# EAGLE design RJ45 4ch Output (EAGLE 9.4.2)
4 channel RJ45 output board. Sends 1 channel of RS485 out + power on each RJ45
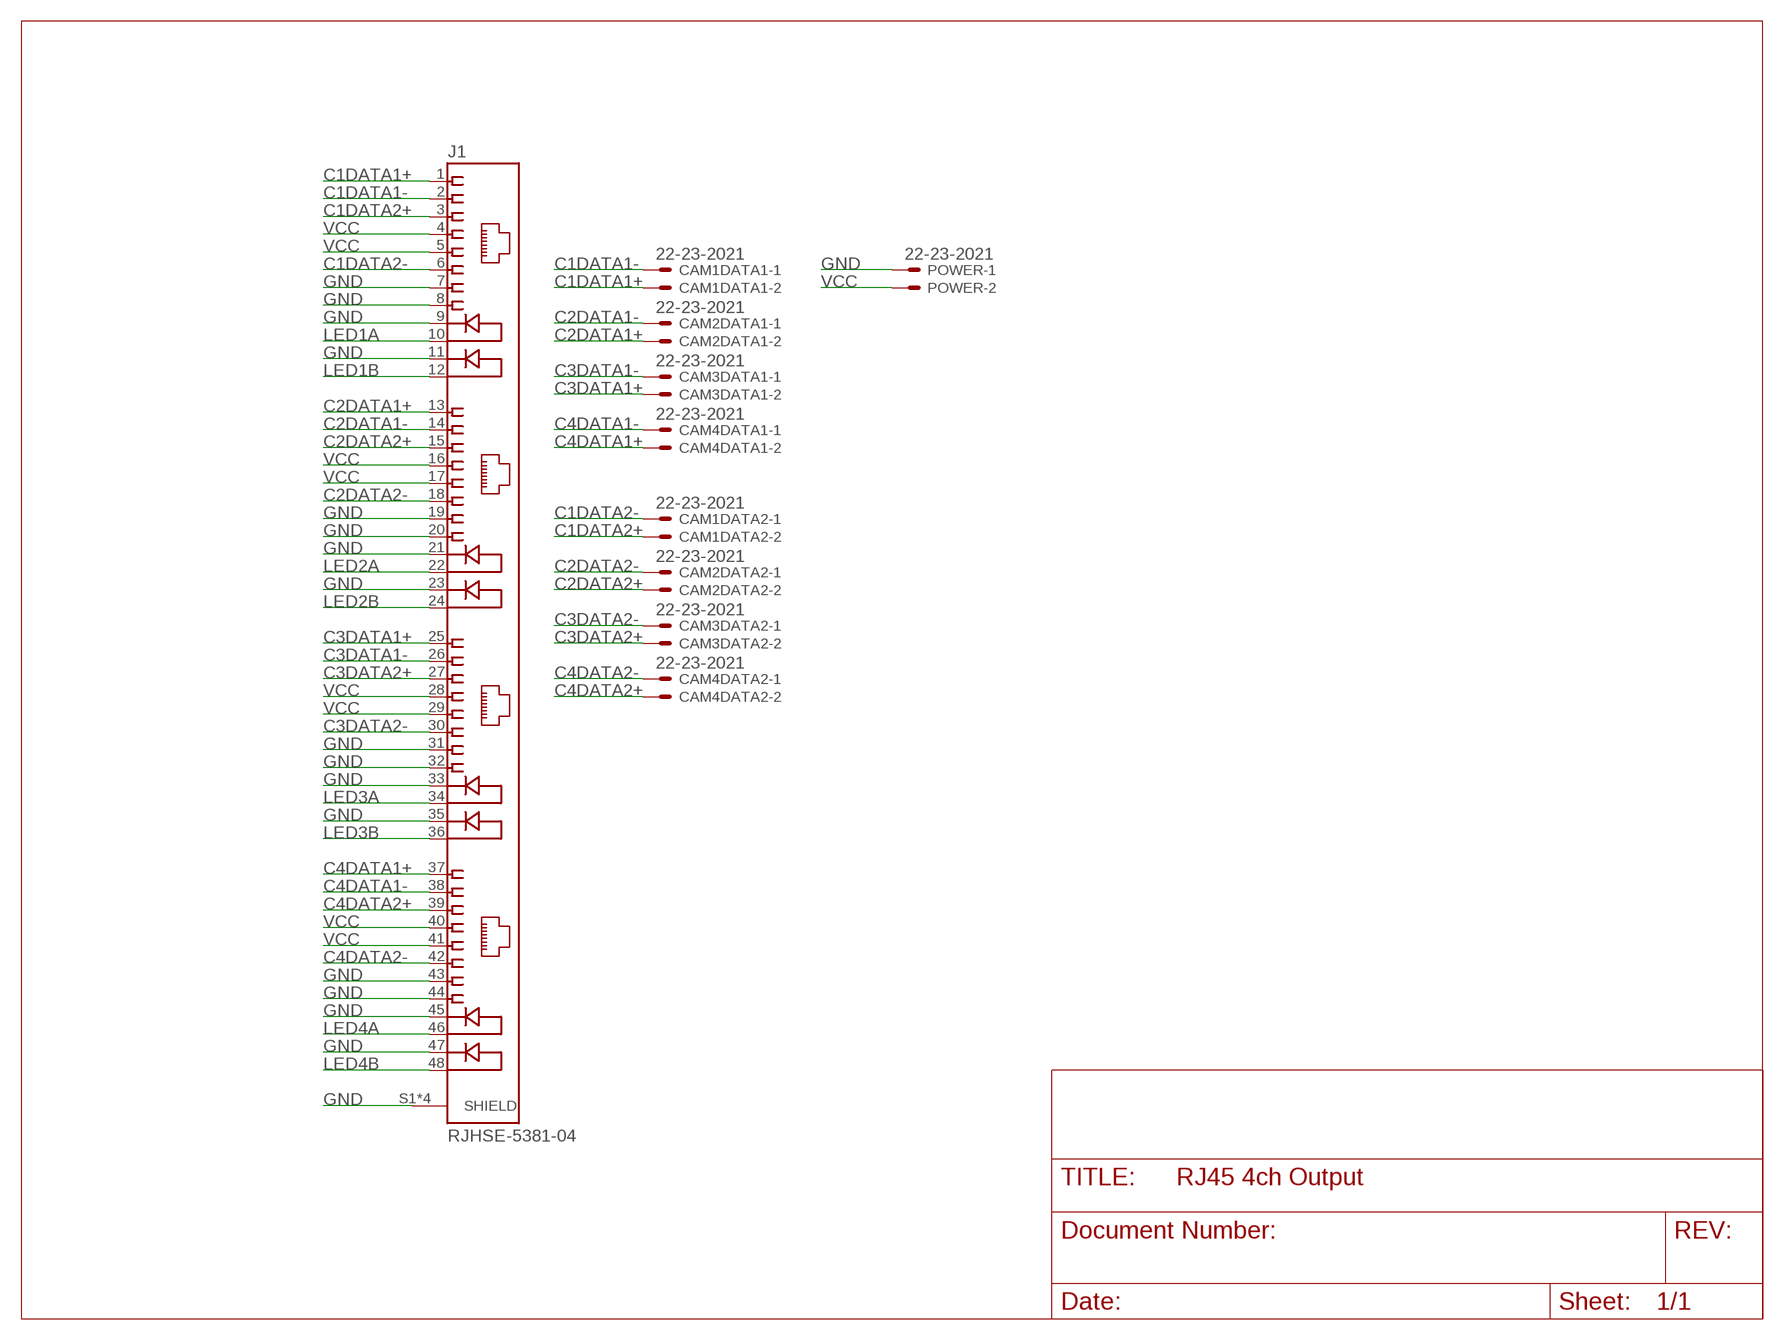
[diagram p0: schematic, sheet 1]

## Parts
CAM1DATA1  22-23-2021  [22-23-2021]
CAM1DATA2  22-23-2021  [22-23-2021]
CAM2DATA1  22-23-2021  [22-23-2021]
CAM2DATA2  22-23-2021  [22-23-2021]
CAM3DATA1  22-23-2021  [22-23-2021]
CAM3DATA2  22-23-2021  [22-23-2021]
CAM4DATA1  22-23-2021  [22-23-2021]
CAM4DATA2  22-23-2021  [22-23-2021]
J1  RJHSE-5381-04  [AMPHENOL_RJHSE-5381-04]
POWER  22-23-2021  [22-23-2021]

## Nets
C1DATA1+: CAM1DATA1.2 J1.1
C1DATA1-: CAM1DATA1.1 J1.2
C1DATA2+: CAM1DATA2.2 J1.3
C1DATA2-: CAM1DATA2.1 J1.6
C2DATA1+: CAM2DATA1.2 J1.13
C2DATA1-: CAM2DATA1.1 J1.14
C2DATA2+: CAM2DATA2.2 J1.15
C2DATA2-: CAM2DATA2.1 J1.18
C3DATA1+: CAM3DATA1.2 J1.25
C3DATA1-: CAM3DATA1.1 J1.26
C3DATA2+: CAM3DATA2.2 J1.27
C3DATA2-: CAM3DATA2.1 J1.30
C4DATA1+: CAM4DATA1.2 J1.37
C4DATA1-: CAM4DATA1.1 J1.38
C4DATA2+: CAM4DATA2.2 J1.39
C4DATA2-: CAM4DATA2.1 J1.42
GND: J1.7 J1.8 J1.9 J1.11 J1.19 J1.20 J1.21 J1.23 J1.31 J1.32 J1.33 J1.35 J1.43 J1.44 J1.45 J1.47 J1.S1(SHIELD) J1.S2(SHIELD) J1.S3(SHIELD) J1.S4(SHIELD) POWER.1
LED1A: J1.10
LED1B: J1.12
LED2A: J1.22
LED2B: J1.24
LED3A: J1.34
LED3B: J1.36
LED4A: J1.46
LED4B: J1.48
VCC: J1.4 J1.5 J1.16 J1.17 J1.28 J1.29 J1.40 J1.41 POWER.2

## Library data of the parts
CAM1DATA1 CAM1DATA2 CAM2DATA1 CAM2DATA2 CAM3DATA1 CAM3DATA2 CAM4DATA1 CAM4DATA2 POWER = con-molex:22-23-2021: .100" (2.54mm) Center Header - 2 Pin; MF: MOLEX; MPN: 22-23-2021; OC_FARNELL: 1462926; OC_NEWARK: 25C3832
J1 = RJHSE-5381-04:RJHSE-5381-04: Conn RJ-45 F 32 POS 2.03mm Solder RA Thru-Hole 48 Terminal 4 Port Cat 5; AVAILABILITY: Unavailable; DESCRIPTION: Conn RJ-45 F 32 POS 2.03mm Solder RA Thru-Hole 48 Terminal 4 Port Cat 5; MF: Amphenol ICC; MP: RJHSE-5381-04; PACKAGE: None; PRICE: None

## Board
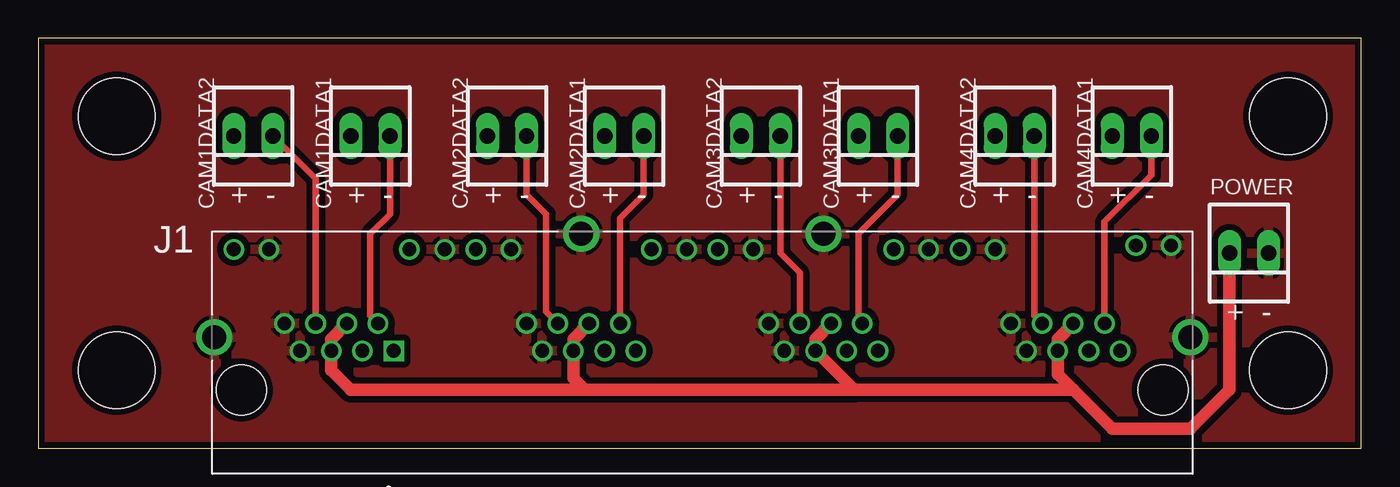
[diagram p1: board, top side]
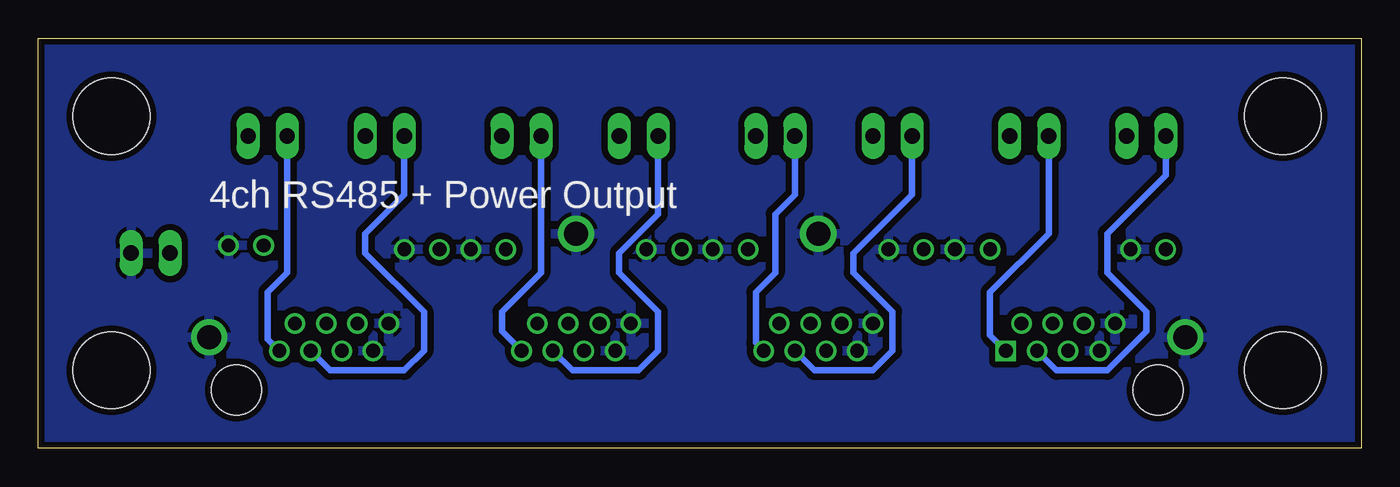
[diagram p2: board, bottom side, seen from below]

Size 86.03 x 26.66 mm. Coordinates in mm from the lower left corner, seen from the top.
Outline: 0,0 86.03,0 86.03,26.66 0,26.66 0,0
Copper layers (1*16): Top 0.035559375mm / dielectric 1.6mm / Bottom 0.035559375mm
Design rules "default": minimum track width 6mil, minimum drill 10mil, track to track 6mil, track to pad 6mil, pad to pad 6mil, via to via 6mil, smd to smd 6mil, copper to edge 15mil, drill to drill 6mil, minimum pad ring 5mil, minimum via ring 5mil, stop-mask expansion 2.5mil, vias tented up to drill 0mil, thermal gap 10mil
Holes 4.98 mm at 5.08,5.08 81.28,5.08 5.08,21.59 81.28,21.59

### Footprints (pad centres in the part's own frame; a part is rotated, then mirrored left to right if it is on the bottom)
22-23-2021 = drill 1 long: 1 -1.27,0; 2 1.27,0
AMPHENOL_RJHSE-5381-04 = drill 0.89 square: 1 -20.075,2.54 | drill 0.89: 2 -21.09,4.32; 3 -22.105,2.54; 4 -23.12,4.32; 5 -24.135,2.54; 6 -25.15,4.32; 7 -26.165,2.54; 8 -27.18,4.32; 9 -16.76,9.14; 10 -19.05,9.14; 11 -28.19,9.14; 12 -30.48,9.14; 13 -4.325,2.54; 14 -5.34,4.32; 15 -6.355,2.54; 16 -7.37,4.32; 17 -8.385,2.54; 18 -9.4,4.32; 19 -10.415,2.54; 20 -11.43,4.32; 21 -1.015,9.14; 22 -3.305,9.14; 23 -12.44,9.14; 24 -14.73,9.14; 25 11.425,2.54; 26 10.41,4.32; 27 9.395,2.54; 28 8.38,4.32; 29 7.365,2.54; 30 6.35,4.32; 31 5.335,2.54; 32 4.32,4.32; 33 14.73,9.14; 34 12.44,9.14; 35 3.305,9.14; 36 1.015,9.14; 37 27.175,2.54; 38 26.16,4.32; 39 25.145,2.54; 40 24.13,4.32; 41 23.115,2.54; 42 22.1,4.32; 43 21.085,2.54; 44 20.07,4.32; 45 30.49,9.395; 46 28.2,9.395; 47 19.05,9.14; 48 16.76,9.14 | drill 1.57: S1 -31.75,3.43; S2 31.75,3.43; S3 -7.875,10.16; S4 7.875,10.16 | hole 3.25: 29.97,0; -29.97,0

### Placement (x,y rotation side)
CAM1DATA1  21.59,20.32 180 top
CAM1DATA2  13.97,20.32 180 top
CAM2DATA1  38.1,20.32 180 top
CAM2DATA2  30.48,20.32 180 top
CAM3DATA1  54.61,20.32 180 top
CAM3DATA2  46.99,20.32 180 top
CAM4DATA1  71.12,20.32 180 top
CAM4DATA2  63.5,20.32 180 top
J1  43.18,3.81 0 top
POWER  78.74,12.7 180 top

### Tracks (layer width: path | path; a pad name or v marks a point on that pad's centre or on a via)
C1DATA1+
  Bottom 0.406: CAM1DATA1.2 20.32,13.97 24.13,10.16 24.13,7.38 J1.1
C1DATA1-
  Top 0.406: CAM1DATA1.1 22.86,15.24 21.59,13.97 21.59,8.63 J1.2
C1DATA2+
  Bottom 0.406: CAM1DATA2.2 12.7,17.78 16.51,13.97 16.51,11.43 13.97,8.89 13.97,7.62 16.51,5.08 19.8,5.08 J1.3
C1DATA2-
  Top 0.406: CAM1DATA2.1 18.03,17.53 J1.6
C2DATA1+
  Bottom 0.406: CAM2DATA1.2 36.83,16.51 38.1,15.24 38.1,11.43 39.37,10.16 39.37,6.87 J1.13
C2DATA1-
  Top 0.406: CAM2DATA1.1 39.37,16.51 37.84,14.98 J1.14
C2DATA2+
  Bottom 0.406: J1.15 35.55,5.08 31.75,5.08 30.48,6.35 30.48,8.89 33.02,11.43 33.02,12.7 29.21,16.51 CAM2DATA2.2
C2DATA2-
  Top 0.406: CAM2DATA2.1 31.75,16.51 33.02,15.24 33.02,8.89 J1.18
C3DATA1+
  Bottom 0.406: CAM3DATA1.2 53.34,11.43 55.88,8.89 55.88,7.62 J1.25
C3DATA1-
  Top 0.406: CAM3DATA1.1 55.88,16.51 53.34,13.97 53.34,8.38 J1.26
C3DATA2+
  Bottom 0.406: J1.27 51.3,5.08 46.99,5.08 45.72,6.35 45.72,8.89 48.26,11.43 48.26,12.7 45.72,15.24 CAM3DATA2.2
C3DATA2-
  Top 0.406: CAM3DATA2.1 48.26,12.7 49.53,11.43 J1.30
C4DATA1+
  Bottom 0.406: CAM4DATA1.2 69.85,11.43 71.12,10.16 71.12,7.12 J1.37
C4DATA1-
  Top 0.406: CAM4DATA1.1 72.39,17.78 69.34,14.73 J1.38
C4DATA2+
  Bottom 0.406: CAM4DATA2.2 62.23,16.51 64.77,13.97 64.77,12.7 60.96,8.89 60.96,6.35 62.23,5.08 67.06,5.08 J1.39
C4DATA2-
  Top 0.406: CAM4DATA2.1 64.77,8.64 J1.42
GND
  pour Top (isolate 0.406): 0,26.67 86.36,26.67 86.36,0 0,0
  pour Bottom (isolate 0.406): 0,26.67 86.36,26.67 86.36,6.35 87.63,5.08 87.63,0 0,0
VCC
  Top 0.813: J1.4 19.05,7.12 J1.5 19.05,5.08 20.32,3.81 35.56,3.81 | 35.56,3.81 53.09,3.81 | 35.56,3.81 34.8,4.58 J1.17 34.8,7.12 J1.16 | J1.28 50.55,7.12 J1.29 53.09,3.81 | 67.31,3.81 53.09,3.81 | J1.40 66.3,7.12 J1.41 66.3,4.83 67.31,3.81 | POWER.2 77.47,3.81 74.93,1.27 69.85,1.27 67.31,3.81

### Text on the board
tNames: + - | + - | + - | + - | + - | + - | + - | + - | + -
bNames: 4ch RS485 + Power Output